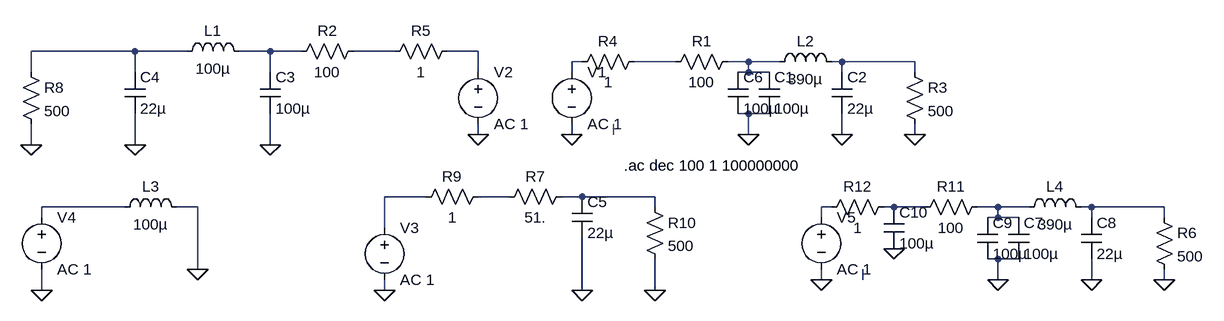
[diagram p0: schematic Power_filter.asc]
Power_filter.asc, the LTspice schematic file:
Version 4
SHEET 1 912 680
WIRE -784 112 -944 112
WIRE -704 112 -784 112
WIRE -576 112 -624 112
WIRE -528 112 -576 112
WIRE -384 112 -448 112
WIRE -256 112 -304 112
WIRE -96 128 -112 128
WIRE 48 128 -16 128
WIRE 160 128 128 128
WIRE 208 128 160 128
WIRE 304 128 288 128
WIRE 416 128 304 128
WIRE -944 144 -944 112
WIRE -784 144 -784 112
WIRE -576 144 -576 112
WIRE -256 144 -256 112
WIRE -112 144 -112 128
WIRE 160 144 160 128
WIRE 160 144 144 144
WIRE 192 144 160 144
WIRE 304 144 304 128
WIRE 416 144 416 128
WIRE 160 208 144 208
WIRE 192 208 160 208
WIRE -256 240 -256 224
WIRE -112 240 -112 224
WIRE -48 240 -48 224
WIRE 160 240 160 208
WIRE 304 240 304 208
WIRE 416 240 416 224
WIRE -944 256 -944 224
WIRE -784 256 -784 208
WIRE -576 256 -576 208
WIRE -336 336 -400 336
WIRE -208 336 -256 336
WIRE -96 336 -128 336
WIRE 16 336 -96 336
WIRE -800 352 -928 352
WIRE -688 352 -720 352
WIRE 16 352 16 336
WIRE 288 352 272 352
WIRE 384 352 368 352
WIRE 432 352 384 352
WIRE 544 352 512 352
WIRE 592 352 544 352
WIRE 688 352 672 352
WIRE 800 352 688 352
WIRE -928 368 -928 352
WIRE 272 368 272 352
WIRE 544 368 544 352
WIRE 544 368 528 368
WIRE 576 368 544 368
WIRE 688 368 688 352
WIRE 800 368 800 352
WIRE -400 384 -400 336
WIRE 544 432 528 432
WIRE 576 432 544 432
WIRE -688 448 -688 352
WIRE 272 464 272 448
WIRE 336 464 336 448
WIRE 544 464 544 432
WIRE 688 464 688 432
WIRE 800 464 800 448
WIRE -928 480 -928 448
WIRE -400 480 -400 464
WIRE -96 480 -96 400
WIRE 16 480 16 432
FLAG 160 240 0
FLAG 304 240 0
FLAG 416 240 0
FLAG -112 240 0
FLAG -576 256 0
FLAG -784 256 0
FLAG -944 256 0
FLAG -256 240 0
FLAG -400 480 0
FLAG -96 480 0
FLAG 16 480 0
FLAG -688 448 0
FLAG -928 480 0
FLAG 544 464 0
FLAG 688 464 0
FLAG 800 464 0
FLAG 272 464 0
FLAG 384 416 0
SYMBOL cap 176 144 R0
SYMATTR InstName C1
SYMATTR Value 100µ
SYMATTR SpiceLine Rser=0.3
SYMBOL cap 288 144 R0
SYMATTR InstName C2
SYMATTR Value 22µ
SYMATTR SpiceLine Rser=0.7
SYMBOL voltage -112 128 R0
SYMATTR InstName V1
SYMATTR Value AC 1
SYMBOL res 400 128 R0
SYMATTR InstName R3
SYMATTR Value 500
SYMBOL res 144 112 R90
WINDOW 0 0 56 VBottom 2
WINDOW 3 32 56 VTop 2
SYMATTR InstName R1
SYMATTR Value 100
SYMBOL res 0 112 R90
WINDOW 0 0 56 VBottom 2
WINDOW 3 32 56 VTop 2
SYMATTR InstName R4
SYMATTR Value 1
SYMBOL voltage -256 128 R0
SYMATTR InstName V2
SYMATTR Value AC 1
SYMBOL res -288 96 R90
WINDOW 0 0 56 VBottom 2
WINDOW 3 32 56 VTop 2
SYMATTR InstName R5
SYMATTR Value 1
SYMBOL cap -592 144 R0
SYMATTR InstName C3
SYMATTR Value 100µ
SYMBOL cap -800 144 R0
SYMATTR InstName C4
SYMATTR Value 22µ
SYMBOL res -960 128 R0
SYMATTR InstName R8
SYMATTR Value 500
SYMBOL voltage -400 368 R0
SYMATTR InstName V3
SYMATTR Value AC 1
SYMBOL res -112 320 R90
WINDOW 0 0 56 VBottom 2
WINDOW 3 32 56 VTop 2
SYMATTR InstName R7
SYMATTR Value 51.
SYMBOL res -240 320 R90
WINDOW 0 0 56 VBottom 2
WINDOW 3 32 56 VTop 2
SYMATTR InstName R9
SYMATTR Value 1
SYMBOL cap -112 336 R0
SYMATTR InstName C5
SYMATTR Value 22µ
SYMBOL res 0 336 R0
SYMATTR InstName R10
SYMATTR Value 500
SYMBOL ind 192 144 R270
WINDOW 0 32 56 VTop 2
WINDOW 3 5 56 VBottom 2
SYMATTR InstName L2
SYMATTR Value 390µ
SYMATTR SpiceLine Rser=36 Cpar=2.6E-12
SYMBOL voltage -928 352 R0
SYMATTR InstName V4
SYMATTR Value AC 1
SYMBOL ind -816 368 R270
WINDOW 0 32 56 VTop 2
WINDOW 3 5 56 VBottom 2
SYMATTR InstName L3
SYMATTR Value 100µ
SYMATTR SpiceLine Rser=35 Cpar=1.76E-12
SYMBOL res -432 96 R90
WINDOW 0 0 56 VBottom 2
WINDOW 3 32 56 VTop 2
SYMATTR InstName R2
SYMATTR Value 100
SYMBOL ind -720 128 R270
WINDOW 0 32 56 VTop 2
WINDOW 3 5 56 VBottom 2
SYMATTR InstName L1
SYMATTR Value 100µ
SYMATTR SpiceLine Rser=21 Cpar=1.76E-12
SYMBOL cap 128 144 R0
SYMATTR InstName C6
SYMATTR Value 100µ
SYMATTR SpiceLine Rser=0.3
SYMBOL cap 560 368 R0
SYMATTR InstName C7
SYMATTR Value 100µ
SYMATTR SpiceLine Rser=0.3
SYMBOL cap 672 368 R0
SYMATTR InstName C8
SYMATTR Value 22µ
SYMATTR SpiceLine Rser=0.7
SYMBOL voltage 272 352 R0
SYMATTR InstName V5
SYMATTR Value AC 1
SYMBOL res 784 352 R0
SYMATTR InstName R6
SYMATTR Value 500
SYMBOL res 528 336 R90
WINDOW 0 0 56 VBottom 2
WINDOW 3 32 56 VTop 2
SYMATTR InstName R11
SYMATTR Value 100
SYMBOL res 384 336 R90
WINDOW 0 0 56 VBottom 2
WINDOW 3 32 56 VTop 2
SYMATTR InstName R12
SYMATTR Value 1
SYMBOL ind 576 368 R270
WINDOW 0 32 56 VTop 2
WINDOW 3 5 56 VBottom 2
SYMATTR InstName L4
SYMATTR Value 390µ
SYMATTR SpiceLine Rser=36 Cpar=2.6E-12
SYMBOL cap 512 368 R0
SYMATTR InstName C9
SYMATTR Value 100µ
SYMATTR SpiceLine Rser=0.3
SYMBOL cap 368 352 R0
SYMATTR InstName C10
SYMATTR Value 100µ
SYMATTR SpiceLine Rser=0.3
TEXT -32 288 Left 2 !.ac dec 100 1 100000000

The netlist it stands for:
* Power_filter.asc
C1 N007 0 100µ Rser=0.3
C2 N008 0 22µ Rser=0.7
V1 N005 0 AC 1
R3 N008 0 500
R1 N007 N006 100
R4 N006 N005 1
V2 N004 0 AC 1
R5 N004 N003 1
C3 N002 0 100µ
C4 N001 0 22µ
R8 N001 0 500
V3 N010 0 AC 1
R7 N012 N011 51.
R9 N011 N010 1
C5 N012 0 22µ
R10 N012 0 500
L2 N007 N008 390µ Rser=36 Cpar=2.6E-12
V4 N013 0 AC 1
L3 N013 0 100µ Rser=35 Cpar=1.76E-12
R2 N003 N002 100
L1 N001 N002 100µ Rser=21 Cpar=1.76E-12
C6 N007 0 100µ Rser=0.3
C7 N016 0 100µ Rser=0.3
C8 N017 0 22µ Rser=0.7
V5 N014 0 AC 1
R6 N017 0 500
R11 N016 N015 100
R12 N015 N014 1
L4 N016 N017 390µ Rser=36 Cpar=2.6E-12
C9 N016 0 100µ Rser=0.3
C10 N015 0 100µ Rser=0.3
.ac dec 100 1 100000000
.backanno
.end